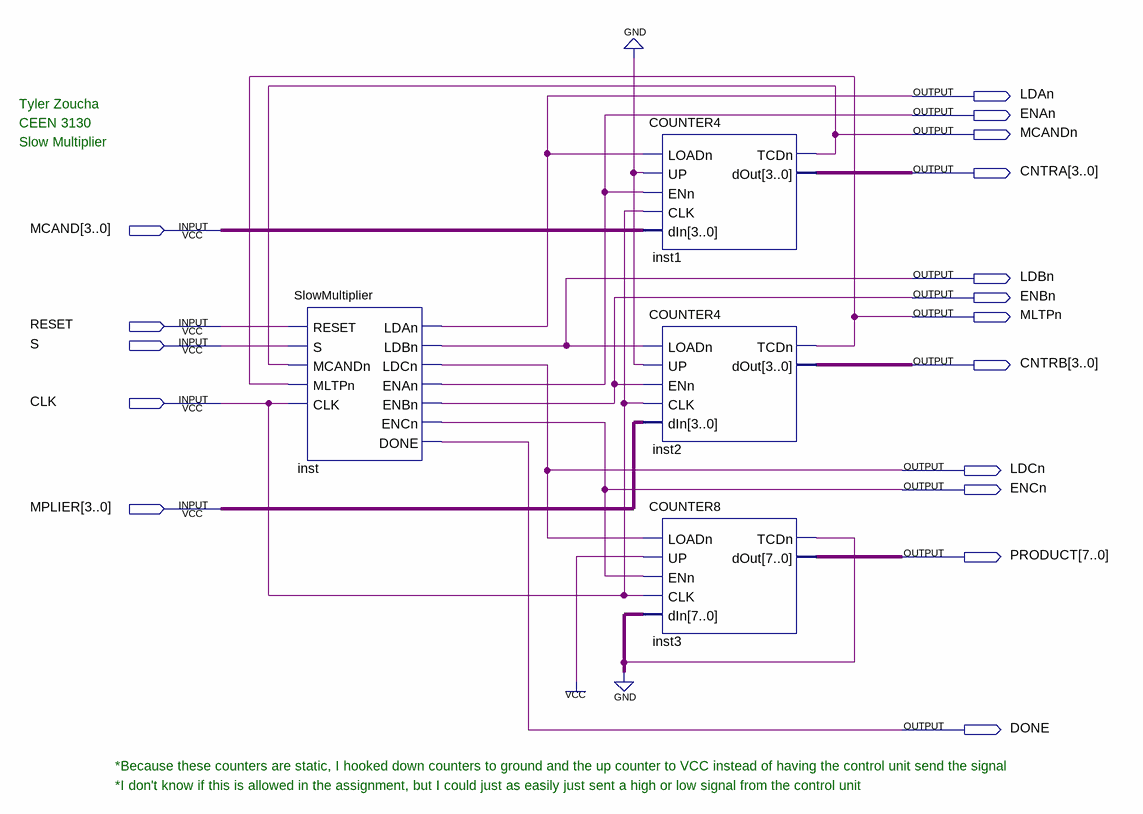
[diagram p0: schematic sheet]
// Quartus schematic Block1.bdf as structural Verilog: 4 symbols, 17 pins
module Block1 (
  input  [3:0] MCAND,
  input  RESET,
  input  S,
  input  CLK,
  input  [3:0] MPLIER,
  output LDAn,
  output ENAn,
  output MCANDn,
  output [3:0] CNTRA,
  output LDBn,
  output ENBn,
  output MLTPn,
  output [3:0] CNTRB,
  output LDCn,
  output ENCn,
  output [7:0] PRODUCT,
  output DONE
);

  wire inst3_tcdn;

  SlowMultiplier inst (
    .RESET(RESET), .S(S), .MCANDn(MCANDn), .MLTPn(MLTPn), .CLK(CLK), .LDAn(LDAn), .LDBn(LDBn), .LDCn(LDCn),
    .ENAn(ENAn), .ENBn(ENBn), .ENCn(ENCn), .DONE(DONE));
  COUNTER4 inst1 (.LOADn(LDAn), .UP(1'b0), .ENn(ENAn), .CLK(CLK), .dIn(MCAND), .TCDn(MCANDn), .dOut(CNTRA));
  COUNTER4 inst2 (.LOADn(LDBn), .UP(1'b0), .ENn(ENBn), .CLK(CLK), .dIn(MPLIER), .TCDn(MLTPn), .dOut(CNTRB));
  COUNTER8 inst3 (.LOADn(LDCn), .UP(1'b1), .ENn(ENCn), .CLK(CLK), .dIn({8{1'b0}}), .TCDn(inst3_tcdn), .dOut(PRODUCT));

  // Notes on the sheet:
  //   Tyler Zoucha
  //   CEEN 3130
  //   Slow Multiplier
  //   *Because these counters are static, I hooked down counters to ground and the up counter to VCC instead of having the control unit send the signal
  //   *I don't know if this is allowed in the assignment, but I could just as easily just sent a high or low signal from the control unit
endmodule
